# Altium project CommunicationBoard.PrjPcb
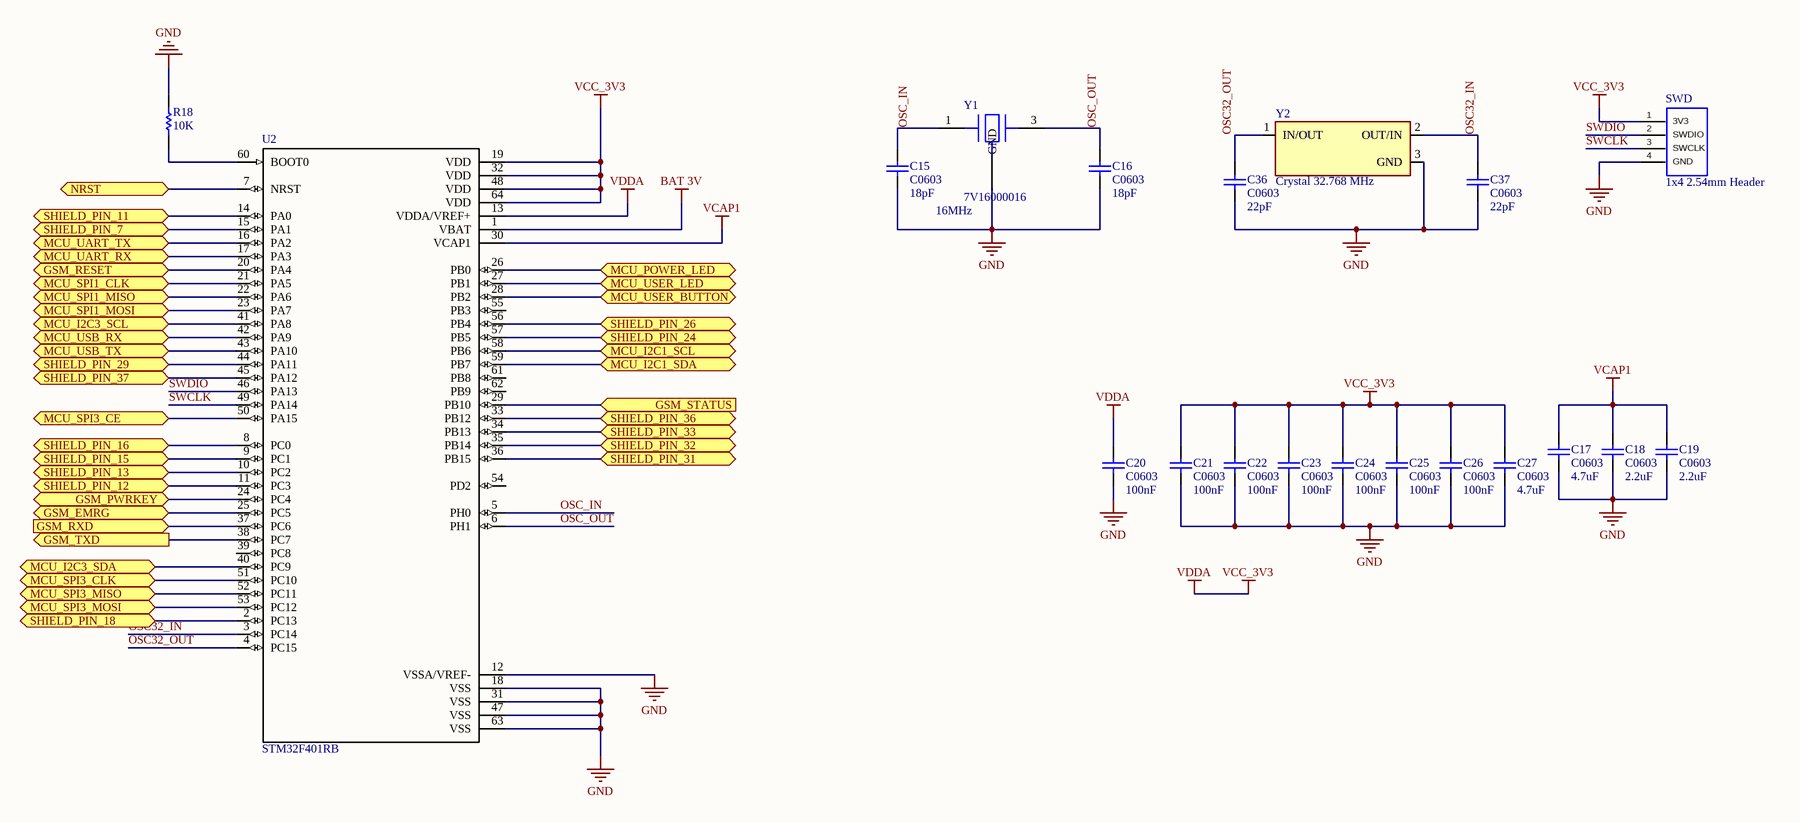
[diagram p0: MCU.SchDoc]
6 sheets, 100 parts. Net scope: flat (ports and power ports of the same name join across sheets).
Board files: CommunicationBoard.PcbDoc, PCB1.PcbDoc
Sheets:
  MCU.SchDoc
  gsm2.SchDoc
  USER_IO.SchDoc
  USB-PC.SchDoc
  POWER.SchDoc
  gsm1.SchDoc

## Sheet MCU.SchDoc
size A3

### Parts
C15  C0603  value 18pF  [C0603]
C16  C0603  value 18pF  [C0603]
C17  C0603  value 4.7uF  [C0603]
C18  C0603  value 2.2uF  [C0603]
C19  C0603  value 2.2uF  [C0603]
C20  C0603  value 100nF  [C0603]
C21  C0603  value 100nF  [C0603]
C22  C0603  value 100nF  [C0603]
C23  C0603  value 100nF  [C0603]
C24  C0603  value 100nF  [C0603]
C25  C0603  value 100nF  [C0603]
C26  C0603  value 100nF  [C0603]
C27  C0603  value 4.7uF  [C0603]
C36  C0603  value 22pF  [C0603]
C37  C0603  value 22pF  [C0603]
R18  value 10K  [CC1608-0603]  (hidden comment: Res0603)
SWD  1x4 2.54mm Header  [1x4 2.54mm Header]
U2  STM32F401RB  [STM32F401RE]
Y1  7V16000016  value 16MHz  [7V16000016]
Y2  Crystal 32.768 MHz  [Crystal 32.768 MHz]

### Ports
GSM_EMRG (bidir), GSM_PWRKEY (bidir), GSM_RESET (bidir), GSM_RXD (in), GSM_STATUS (in), GSM_TXD (out), MCU_I2C1_SCL, MCU_I2C1_SDA, MCU_I2C3_SCL, MCU_I2C3_SDA, MCU_POWER_LED, MCU_SPI1_CLK, MCU_SPI1_MISO, MCU_SPI1_MOSI, MCU_SPI3_CE, MCU_SPI3_CLK, MCU_SPI3_MISO, MCU_SPI3_MOSI, MCU_UART_RX, MCU_UART_TX, MCU_USB_RX, MCU_USB_TX, MCU_USER_BUTTON, MCU_USER_LED, NRST, SHIELD_PIN_7, SHIELD_PIN_11, SHIELD_PIN_12, SHIELD_PIN_13, SHIELD_PIN_15, SHIELD_PIN_16, SHIELD_PIN_18, SHIELD_PIN_24, SHIELD_PIN_26, SHIELD_PIN_29, SHIELD_PIN_31, SHIELD_PIN_32, SHIELD_PIN_33, SHIELD_PIN_36, SHIELD_PIN_37

### Nets
BAT 3V: U2.1(VBAT)
GND: C15.1 C16.1 C17.2 C18.2 C19.2 C20.2 C21.1 C22.1 C23.1 C24.1 C25.1 C26.1 C27.1 C36.2 C37.2 R18.1 SWD.4(GND) U2.12(VSSA/VREF-) U2.18(VSS) U2.31(VSS) U2.47(VSS) U2.63(VSS) Y1.2(GND) Y2.3(GND)
VCAP1: C17.1 C18.1 C19.1 U2.30(VCAP1)
VCC_3V3: C20.1 C21.2 C22.2 C23.2 C24.2 C25.2 C26.2 C27.2 SWD.1(3V3) U2.13(VDDA/VREF+) U2.19(VDD) U2.32(VDD) U2.48(VDD) U2.64(VDD)  [also labelled VDDA]
GSM_EMRG: U2.25(PC5) ; port GSM_EMRG
GSM_PWRKEY: U2.24(PC4) ; port GSM_PWRKEY
GSM_RXD: U2.37(PC6) ; port GSM_RXD
GSM_STATUS: U2.29(PB10) ; port GSM_STATUS
GSM_TXD: U2.38(PC7) ; port GSM_TXD
MCU_POWER_LED: U2.26(PB0) ; port MCU_POWER_LED
MCU_USER_BUTTON: U2.28(PB2) ; port MCU_USER_BUTTON
MCU_USER_LED: U2.27(PB1) ; port MCU_USER_LED
OSC32_IN: C37.1 U2.3(PC14) Y2.2(OUT/IN)
OSC32_OUT: C36.1 U2.4(PC15) Y2.1(IN/OUT)
OSC_IN: C15.2 U2.5(PH0) Y1.1
OSC_OUT: C16.2 U2.6(PH1) Y1.3
~{RESET}: U2.20(PA4) ; port GSM_RESET
SWCLK: SWD.3(SWCLK) U2.49(PA14)
SWDIO: SWD.2(SWDIO) U2.46(PA13)
USB-RXD: U2.42(PA9) ; port MCU_USB_RX
USB-TXD: U2.43(PA10) ; port MCU_USB_TX
NetR18_2: R18.2 U2.60(BOOT0)
NetR27_2: U2.7(NRST) ; port NRST
NetShield_3: U2.59(PB7) ; port MCU_I2C1_SDA
NetShield_5: U2.58(PB6) ; port MCU_I2C1_SCL
NetShield_7: U2.15(PA1) ; port SHIELD_PIN_7
NetShield_8: U2.16(PA2) ; port MCU_UART_TX
NetShield_10: U2.17(PA3) ; port MCU_UART_RX
NetShield_11: U2.14(PA0) ; port SHIELD_PIN_11
NetShield_12: U2.11(PC3) ; port SHIELD_PIN_12
NetShield_13: U2.10(PC2) ; port SHIELD_PIN_13
NetShield_15: U2.9(PC1) ; port SHIELD_PIN_15
NetShield_16: U2.8(PC0) ; port SHIELD_PIN_16
NetShield_18: U2.2(PC13) ; port SHIELD_PIN_18
NetShield_19: U2.53(PC12) ; port MCU_SPI3_MOSI
NetShield_21: U2.52(PC11) ; port MCU_SPI3_MISO
NetShield_22: U2.50(PA15) ; port MCU_SPI3_CE
NetShield_23: U2.51(PC10) ; port MCU_SPI3_CLK
NetShield_24: U2.57(PB5) ; port SHIELD_PIN_24
NetShield_26: U2.56(PB4) ; port SHIELD_PIN_26
NetShield_27: U2.40(PC9) ; port MCU_I2C3_SDA
NetShield_28: U2.41(PA8) ; port MCU_I2C3_SCL
NetShield_29: U2.44(PA11) ; port SHIELD_PIN_29
NetShield_31: U2.36(PB15) ; port SHIELD_PIN_31
NetShield_32: U2.35(PB14) ; port SHIELD_PIN_32
NetShield_33: U2.34(PB13) ; port SHIELD_PIN_33
NetShield_35: U2.22(PA6) ; port MCU_SPI1_MISO
NetShield_36: U2.33(PB12) ; port SHIELD_PIN_36
NetShield_37: U2.45(PA12) ; port SHIELD_PIN_37
NetShield_38: U2.23(PA7) ; port MCU_SPI1_MOSI
NetShield_40: U2.21(PA5) ; port MCU_SPI1_CLK

Not connected (* = marked no-connect by the designer): U2 39(PC8) 54(PD2) 55(PB3) 61(PB8) 62(PB9); Y1 4,1(GND)

### Library data of the parts
C15-C27 C36 C37 = C0603: Ceramic Chip Capacitor - Standard; Note: Footprint corresponds to dimensions for bulk cassette packaging. This case size has tightened tolerances.; Published: 17-Jul-2002; LatestRevisionDate: 19-Mar-2004; LatestRevisionNote: Silkscreen size reduced.; DatasheetDocument: Mar-2001; PackageDocument: Mar-2001; PackageReference: 0603; Publisher: Altium Limited; Code_JEITA: 0603; Code_IPC: 1608 [0603]; ComponentLink1Description: Manufacturer Link; ComponentLink1URL: http://www.kemet.com/; ComponentLink2Description: Datasheet; ComponentLink2URL: http://www.kemet.com/kemet/web/homepage/kechome.nsf/vapubfilesname/F3102TA.pdf/$file/F3102TA.pdf
R18 = Res0603: Resistor; Manufacturer: Generic Components; Class I: Passive; Published: 8-Jun-2000; Revision: July-2002: Re-released for DXP Platform.; Publisher: Altium Limited; Class II: Resistor
U2 = STM32F401RE

## Sheet gsm2.SchDoc
size A4
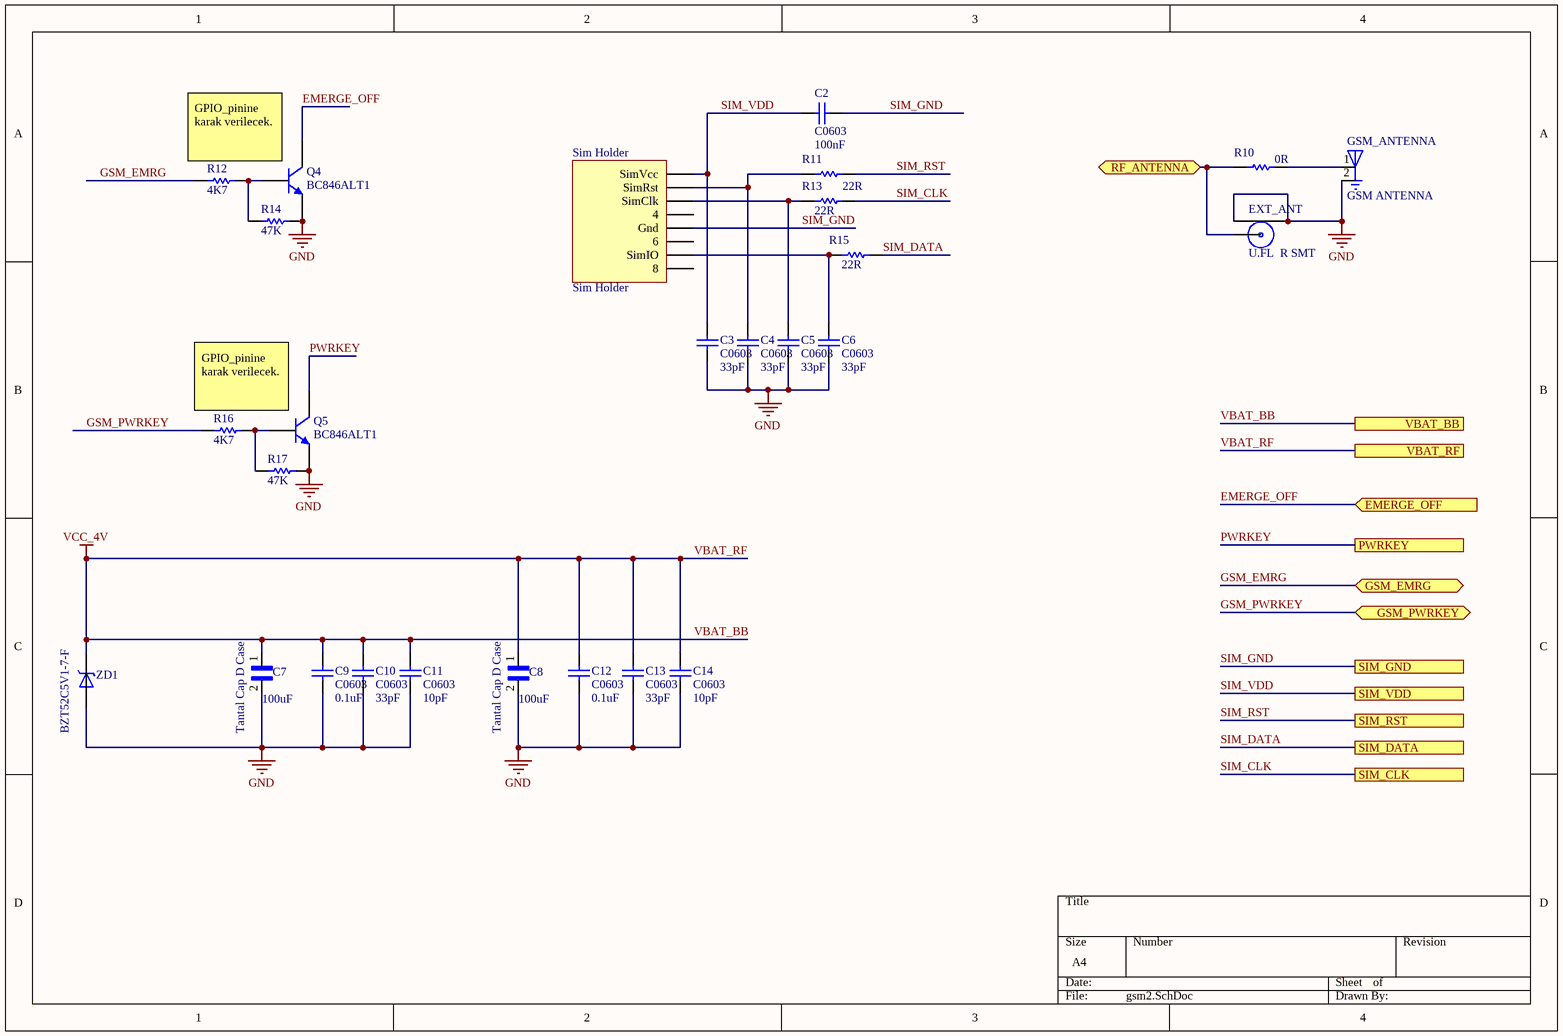
[diagram p1: gsm2.SchDoc]

### Parts
C2  C0603  value 100nF  [C0603]
C3  C0603  value 33pF  [C0603]
C4  C0603  value 33pF  [C0603]
C5  C0603  value 33pF  [C0603]
C6  C0603  value 33pF  [C0603]
C7  Tantal Cap D Case  value 100uF  [Tantal Cap D Case]
C8  Tantal Cap D Case  value 100uF  [Tantal Cap D Case]
C9  C0603  value 0.1uF  [C0603]
C10  C0603  value 33pF  [C0603]
C11  C0603  value 10pF  [C0603]
C12  C0603  value 0.1uF  [C0603]
C13  C0603  value 33pF  [C0603]
C14  C0603  value 10pF  [C0603]
EXT_ANT  U.FL  R SMT  [U.FL  R SMT]
GSM_ANTENNA  GSM ANTENNA  [GSM ANTENNA]
Q4  BC846ALT1  [BC846]
Q5  BC846ALT1  [BC846]
R10  value 0R  [CC1608-0603]  (hidden comment: Res0603)
R11  value 22R  [CC1608-0603]  (hidden comment: Res0603)
R12  value 4K7  [CC1608-0603]  (hidden comment: Res0603)
R13  value 22R  [CC1608-0603]  (hidden comment: Res0603)
R14  value 47K  [CC1608-0603]  (hidden comment: Res0603)
R15  value 22R  [CC1608-0603]  (hidden comment: Res0603)
R16  value 4K7  [CC1608-0603]  (hidden comment: Res0603)
R17  value 47K  [CC1608-0603]  (hidden comment: Res0603)
Sim_Holder  Sim Holder  [SIM HOLDER]
ZD1  BZT52C5V1-7-F  [BZT52C5V1]

### Ports
EMERGE_OFF (in), GSM_EMRG (bidir), GSM_PWRKEY (bidir), PWRKEY, RF_ANTENNA (bidir), SIM_CLK, SIM_DATA, SIM_GND, SIM_RST, SIM_VDD, VBAT_BB, VBAT_RF

### Nets
GND: C3.1 C4.1 C5.1 C6.1 C7.2 C8.2 C9.1 C10.1 C11.1 C12.1 C13.1 C14.1 EXT_ANT.P$2 EXT_ANT.P$3 GSM_ANTENNA.2(GND) Q4.2(E) Q5.2(E) R14.2 R17.2 ZD1.A
VBAT_BB: C7.1 C8.1 C9.2 C10.2 C11.2 C12.2 C13.2 C14.2 ZD1.C ; port VBAT_BB, port VBAT_RF  [also labelled VBAT_RF, VCC_4V]
EMERGE_OFF: Q4.3(C) ; port EMERGE_OFF
GSM_EMRG: R12.1 ; port GSM_EMRG
GSM_PWRKEY: R16.1 ; port GSM_PWRKEY
PWRKEY: Q5.3(C) ; port PWRKEY
RF_ANTENNA: EXT_ANT.P$1 R10.1 ; port RF_ANTENNA
SIM_CLK: R13.2 ; port SIM_CLK
SIM_DATA: R15.2 ; port SIM_DATA
SIM_GND: C2.2 Sim_Holder.5(Gnd) ; port SIM_GND
SIM_RST: R11.2 ; port SIM_RST
SIM_VDD: C2.1 C3.2 Sim_Holder.1(SimVcc) ; port SIM_VDD
NetC4_2: C4.2 R11.1 Sim_Holder.2(SimRst)
NetC5_2: C5.2 R13.1 Sim_Holder.3(SimClk)
NetC6_2: C6.2 R15.1 Sim_Holder.7(SimIO)
NetGSM_ANTENNA_1: GSM_ANTENNA.1(FEEDING) R10.2
NetQ4_1: Q4.1(B) R12.2 R14.1
NetQ5_1: Q5.1(B) R16.2 R17.1

Not connected (* = marked no-connect by the designer): Sim_Holder 4 6 8

### Notes on the sheet
- (near Q4) GPIO_pinine karak verilecek.
- (near Q5) GPIO_pinine karak verilecek.

### Library data of the parts
C2-C6 C9-C14 = C0603: as C15 on sheet MCU; Published: 17-Jul-2002; LatestRevisionDate: 19-Mar-2004; LatestRevisionNote: Silkscreen size reduced.; DatasheetDocument: Mar-2001; PackageDocument: Mar-2001; PackageReference: 0603; Publisher: Altium Limited; Code_JEITA: 0603; Code_IPC: 1608 [0603]; ComponentLink1Description: Manufacturer Link; ComponentLink1URL: http://www.kemet.com/; ComponentLink2Description: Datasheet; ComponentLink2URL: http://www.kemet.com/kemet/web/homepage/kechome.nsf/vapubfilesname/F3102TA.pdf/$file/F3102TA.pdf
Q4 Q5 = BC846ALT1: General Purpose Transistor NPN Silicon; Published: 29-Sep-2000; LatestRevisionDate: 17-Jul-2002; LatestRevisionNote: Re-released for DXP Platform.; DatasheetVersion: 1997; PackageVersion: 1997; PackageReference: 318-08; Publisher: Altium Limited; PackageDescription: SOT-23; 3 Leads; Body 3.0 x 2.6 mm, inc. leads (LxW max); ComponentLink1Description: Manufacturer Link; ComponentLink1URL: http://www.onsemi.com/site/products/landing?taxonomyID=194; ComponentLink2Description: Datasheet; ComponentLink2URL: http://www.onsemi.com/pub/Collateral/BC846ALT1-D.PDF
R10-R17 = Res0603: as R18 on sheet MCU; Published: 8-Jun-2000; Revision: July-2002: Re-released for DXP Platform.; Publisher: Altium Limited; Class II: Resistor

## Sheet USER_IO.SchDoc
size A4
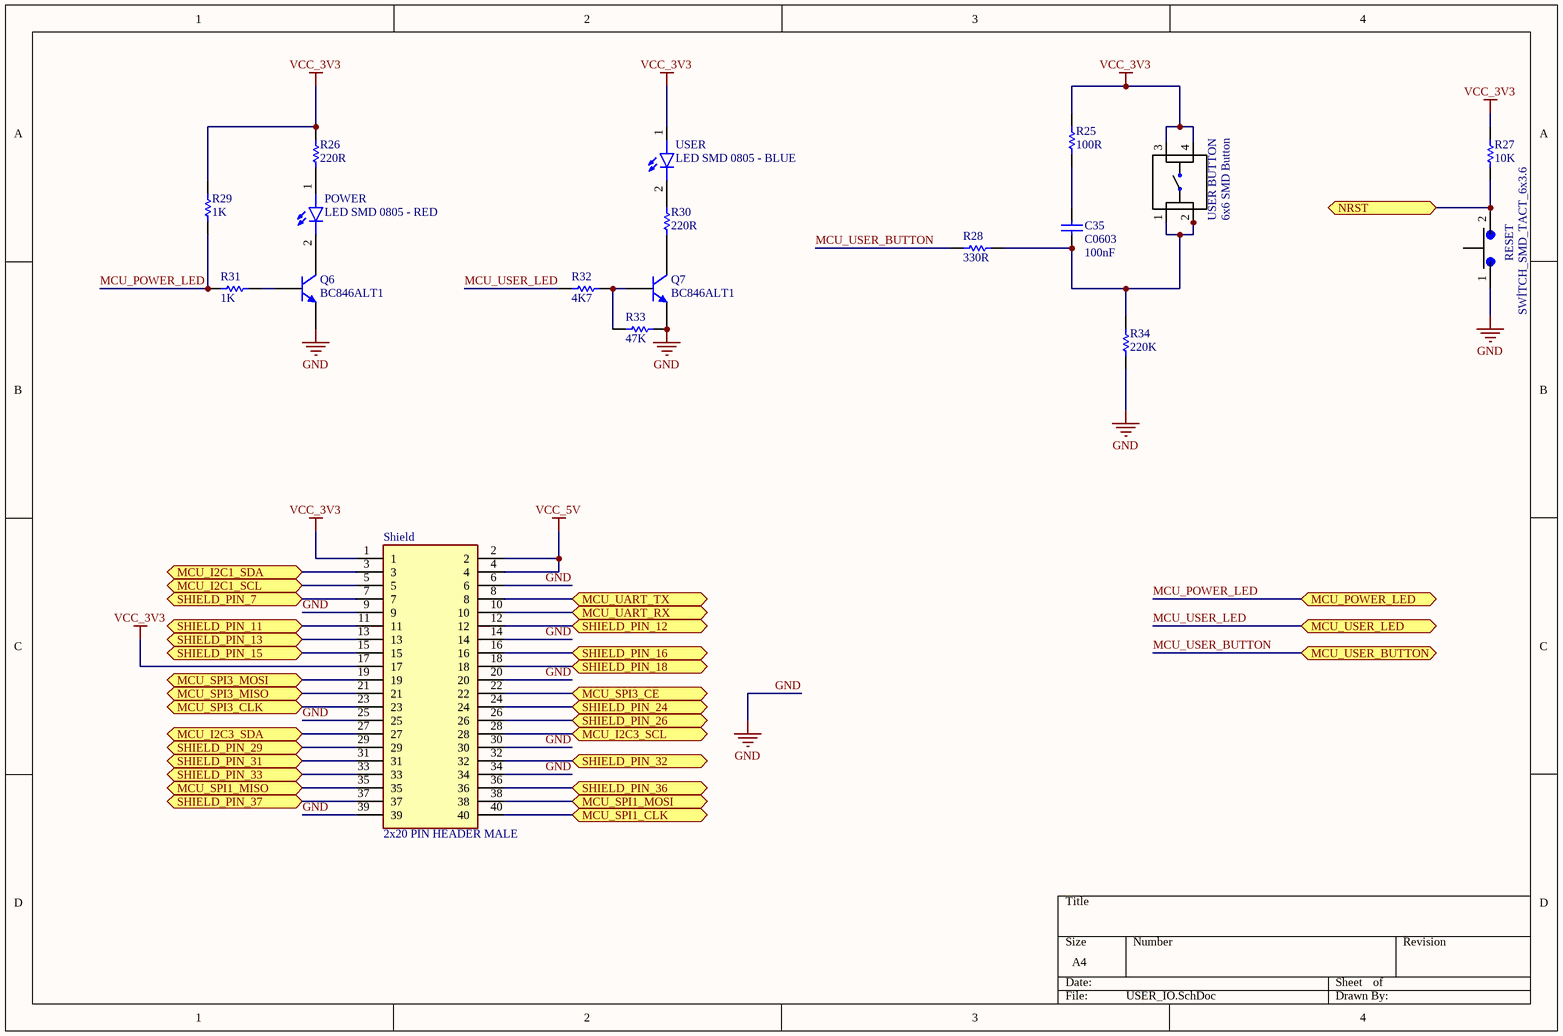
[diagram p2: USER_IO.SchDoc]

### Parts
C35  C0603  value 100nF  [C0603]
POWER  LED SMD 0805 - RED  [LED SMD 0805 - RED]
Q6  BC846ALT1  [BC846]
Q7  BC846ALT1  [BC846]
R25  value 100R  [CC1608-0603]  (hidden comment: Res0603)
R26  value 220R  [CC1608-0603]  (hidden comment: Res0603)
R27  value 10K  [CC1608-0603]  (hidden comment: Res0603)
R28  value 330R  [CC1608-0603]  (hidden comment: Res0603)
R29  value 1K  [CC1608-0603]  (hidden comment: Res0603)
R30  value 220R  [CC1608-0603]  (hidden comment: Res0603)
R31  value 1K  [CC1608-0603]  (hidden comment: Res0603)
R32  value 4K7  [CC1608-0603]  (hidden comment: Res0603)
R33  value 47K  [CC1608-0603]  (hidden comment: Res0603)
R34  value 220K  [CC1608-0603]  (hidden comment: Res0603)
RESET  SWİTCH_SMD_TACT_6x3.6  [SWİTCH_SMD_TACT_6X3.6]
Shield  2x20 PIN HEADER MALE  [2x20 PIN HEADER MALE]
USER  LED SMD 0805 - BLUE  [LED SMD 0805 - BLUE]
USER_BUTTON  6x6 SMD Button  [6x6 Smd Button]

### Ports
MCU_I2C1_SCL, MCU_I2C1_SDA, MCU_I2C3_SCL, MCU_I2C3_SDA, MCU_POWER_LED, MCU_SPI1_CLK, MCU_SPI1_MISO, MCU_SPI1_MOSI, MCU_SPI3_CE, MCU_SPI3_CLK, MCU_SPI3_MISO, MCU_SPI3_MOSI, MCU_UART_RX, MCU_UART_TX, MCU_USER_BUTTON, MCU_USER_LED, NRST, SHIELD_PIN_7, SHIELD_PIN_11, SHIELD_PIN_12, SHIELD_PIN_13, SHIELD_PIN_15, SHIELD_PIN_16, SHIELD_PIN_18, SHIELD_PIN_24, SHIELD_PIN_26, SHIELD_PIN_29, SHIELD_PIN_31, SHIELD_PIN_32, SHIELD_PIN_33, SHIELD_PIN_36, SHIELD_PIN_37

### Nets
GND: Q6.2(E) Q7.2(E) R33.1 R34.1 RESET.1 Shield.6 Shield.9 Shield.14 Shield.20 Shield.25 Shield.30 Shield.34 Shield.39
VCC_3V3: R25.1 R26.2 R27.1 R29.2 Shield.1 Shield.17 USER.1 USER_BUTTON.3 USER_BUTTON.4
VCC_5V: Shield.2 Shield.4
MCU_POWER_LED: R29.1 R31.2 ; port MCU_POWER_LED
MCU_USER_BUTTON: R28.2 ; port MCU_USER_BUTTON
MCU_USER_LED: R32.2 ; port MCU_USER_LED
NetC35_1: C35.1 R28.1 R34.2 USER_BUTTON.1 USER_BUTTON.2
NetC35_2: C35.2 R25.2
NetPOWER_1: POWER.1 R26.1
NetPOWER_2: POWER.2 Q6.3(C)
NetQ6_1: Q6.1(B) R31.1
NetQ7_1: Q7.1(B) R32.1 R33.2
NetQ7_3: Q7.3(C) R30.2
NetR27_2: R27.2 RESET.2 ; port NRST
NetR30_1: R30.1 USER.2
NetShield_3: Shield.3 ; port MCU_I2C1_SDA
NetShield_5: Shield.5 ; port MCU_I2C1_SCL
NetShield_7: Shield.7 ; port SHIELD_PIN_7
NetShield_8: Shield.8 ; port MCU_UART_TX
NetShield_10: Shield.10 ; port MCU_UART_RX
NetShield_11: Shield.11 ; port SHIELD_PIN_11
NetShield_12: Shield.12 ; port SHIELD_PIN_12
NetShield_13: Shield.13 ; port SHIELD_PIN_13
NetShield_15: Shield.15 ; port SHIELD_PIN_15
NetShield_16: Shield.16 ; port SHIELD_PIN_16
NetShield_18: Shield.18 ; port SHIELD_PIN_18
NetShield_19: Shield.19 ; port MCU_SPI3_MOSI
NetShield_21: Shield.21 ; port MCU_SPI3_MISO
NetShield_22: Shield.22 ; port MCU_SPI3_CE
NetShield_23: Shield.23 ; port MCU_SPI3_CLK
NetShield_24: Shield.24 ; port SHIELD_PIN_24
NetShield_26: Shield.26 ; port SHIELD_PIN_26
NetShield_27: Shield.27 ; port MCU_I2C3_SDA
NetShield_28: Shield.28 ; port MCU_I2C3_SCL
NetShield_29: Shield.29 ; port SHIELD_PIN_29
NetShield_31: Shield.31 ; port SHIELD_PIN_31
NetShield_32: Shield.32 ; port SHIELD_PIN_32
NetShield_33: Shield.33 ; port SHIELD_PIN_33
NetShield_35: Shield.35 ; port MCU_SPI1_MISO
NetShield_36: Shield.36 ; port SHIELD_PIN_36
NetShield_37: Shield.37 ; port SHIELD_PIN_37
NetShield_38: Shield.38 ; port MCU_SPI1_MOSI
NetShield_40: Shield.40 ; port MCU_SPI1_CLK

### Library data of the parts
C35 = C0603: as C15 on sheet MCU; Published: 17-Jul-2002; LatestRevisionDate: 19-Mar-2004; LatestRevisionNote: Silkscreen size reduced.; DatasheetDocument: Mar-2001; PackageDocument: Mar-2001; PackageReference: 0603; Publisher: Altium Limited; Code_JEITA: 0603; Code_IPC: 1608 [0603]; ComponentLink1Description: Manufacturer Link; ComponentLink1URL: http://www.kemet.com/; ComponentLink2Description: Datasheet; ComponentLink2URL: http://www.kemet.com/kemet/web/homepage/kechome.nsf/vapubfilesname/F3102TA.pdf/$file/F3102TA.pdf
Q6 Q7 = BC846ALT1: General Purpose Transistor NPN Silicon; Published: 29-Sep-2000; LatestRevisionDate: 17-Jul-2002; LatestRevisionNote: Re-released for DXP Platform.; DatasheetVersion: 1997; PackageVersion: 1997; PackageReference: 318-08; Publisher: Altium Limited; PackageDescription: SOT-23; 3 Leads; Body 3.0 x 2.6 mm, inc. leads (LxW max); ComponentLink1Description: Manufacturer Link; ComponentLink1URL: http://www.onsemi.com/site/products/landing?taxonomyID=194; ComponentLink2Description: Datasheet; ComponentLink2URL: http://www.onsemi.com/pub/Collateral/BC846ALT1-D.PDF
R25-R34 = Res0603: as R18 on sheet MCU; Published: 8-Jun-2000; Revision: July-2002: Re-released for DXP Platform.; Publisher: Altium Limited; Class II: Resistor

## Sheet USB-PC.SchDoc
size A4
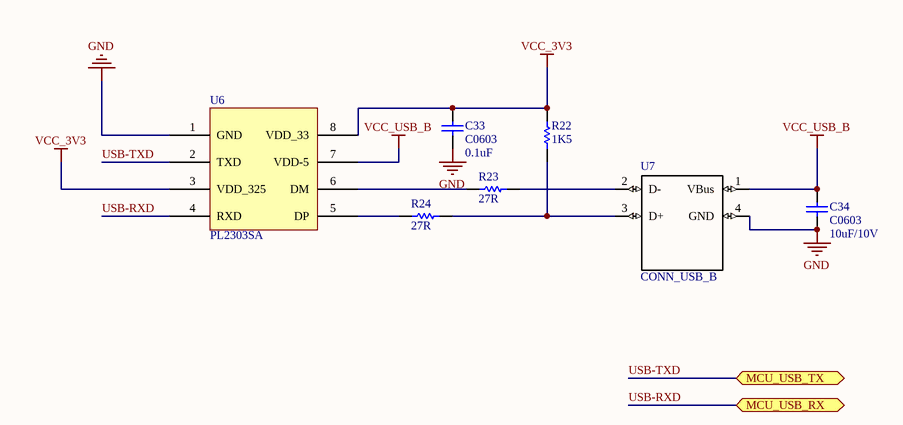
[diagram p3: USB-PC.SchDoc]

### Parts
C33  C0603  value 0.1uF  [C0603]
C34  C0603  value 10uF/10V  [C0603]
R22  value 1K5  [CC1608-0603]  (hidden comment: Res0603)
R23  value 27R  [CC1608-0603]  (hidden comment: Res0603)
R24  value 27R  [CC1608-0603]  (hidden comment: Res0603)
U6  PL2303SA  [PL2302SA]
U7  CONN_USB_B  [CONN_USB_B]

### Ports
MCU_USB_RX, MCU_USB_TX

### Nets
GND: C33.1 C34.1 U6.1(GND) U7.4(GND)
VCC_3V3: C33.2 R22.2 U6.3(VDD_325) U6.8(VDD_33)
VCC_USB_B: C34.2 U6.7(VDD-5) U7.1(VBus)
USB-RXD: U6.4(RXD) ; port MCU_USB_RX
USB-TXD: U6.2(TXD) ; port MCU_USB_TX
NetR22_1: R22.1 R24.1 U7.3(D+)
NetR23_1: R23.1 U7.2(D-)
NetR23_2: R23.2 U6.6(DM)
NetR24_2: R24.2 U6.5(DP)

### Library data of the parts
C33 C34 = C0603: as C15 on sheet MCU; Published: 17-Jul-2002; LatestRevisionDate: 19-Mar-2004; LatestRevisionNote: Silkscreen size reduced.; DatasheetDocument: Mar-2001; PackageDocument: Mar-2001; PackageReference: 0603; Publisher: Altium Limited; Code_JEITA: 0603; Code_IPC: 1608 [0603]; ComponentLink1Description: Manufacturer Link; ComponentLink1URL: http://www.kemet.com/; ComponentLink2Description: Datasheet; ComponentLink2URL: http://www.kemet.com/kemet/web/homepage/kechome.nsf/vapubfilesname/F3102TA.pdf/$file/F3102TA.pdf
R22-R24 = Res0603: as R18 on sheet MCU; Published: 8-Jun-2000; Revision: July-2002: Re-released for DXP Platform.; Publisher: Altium Limited; Class II: Resistor

## Sheet POWER.SchDoc
size A4
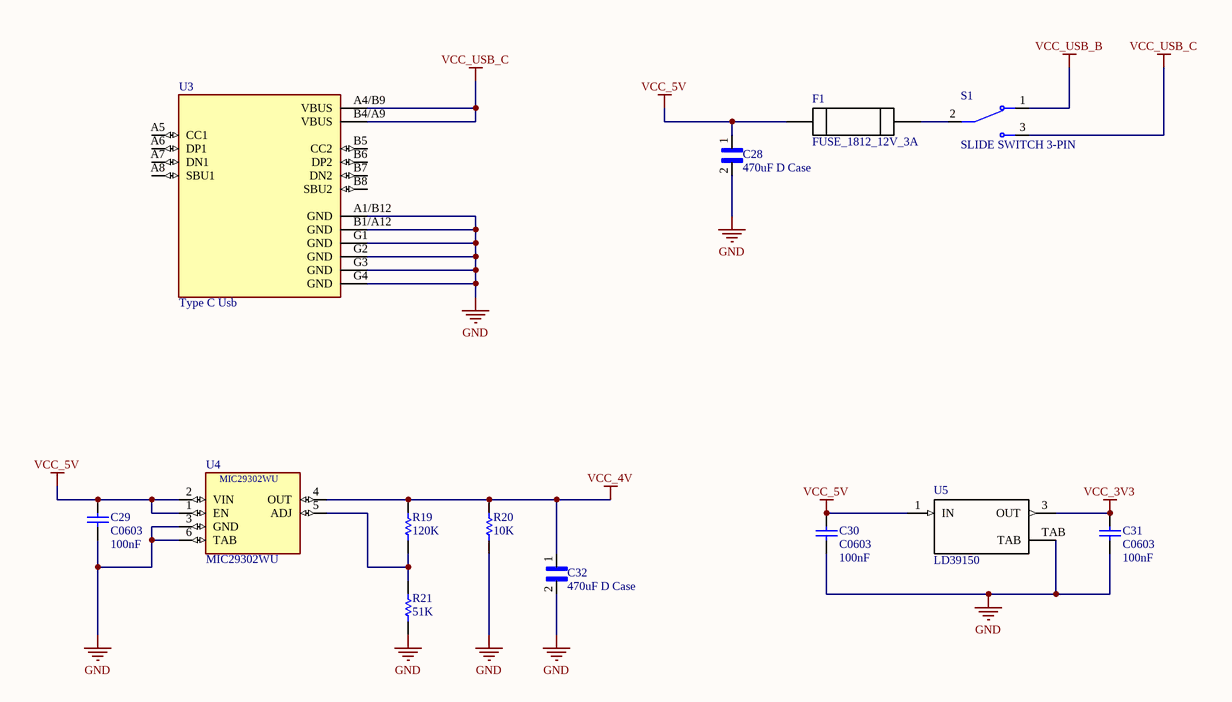
[diagram p4: POWER.SchDoc]

### Parts
C28  470uF D Case  [470uF D Case]
C29  C0603  value 100nF  [C0603]
C30  C0603  value 100nF  [C0603]
C31  C0603  value 100nF  [C0603]
C32  470uF D Case  [470uF D Case]
F1  FUSE_1812_12V_3A  [FUSE_1812_12V_3A]
R19  value 120K  [CC1608-0603]  (hidden comment: Res0603)
R20  value 10K  [CC1608-0603]  (hidden comment: Res0603)
R21  value 51K  [CC1608-0603]  (hidden comment: Res0603)
S1  SLIDE SWITCH 3-PIN  [Slide Switch 3-Pin]
U3  Type C Usb  [Type C Usb]
U4  MIC29302WU  [MIC29302WU]
U5  LD39150  [LD39150DT33-R]

### Nets
GND: C28.2 C29.1 C30.1 C31.1 C32.2 R20.2 R21.2 U3.A1/B12(GND) U3.B1/A12(GND) U3.G1(GND) U3.G2(GND) U3.G3(GND) U3.G4(GND) U4.3(GND) U4.6(TAB) U5.TAB
VCC_3V3: C31.2 U5.3(OUT)
VCC_4V: C32.1 R19.1 R20.1 U4.4(OUT)  [project net VBAT_BB]
VCC_5V: C28.1 C29.2 C30.2 F1.1 U4.1(EN) U4.2(VIN) U5.1(IN)
VCC_USB_B: S1.1
VCC_USB_C: S1.3 U3.A4/B9(VBUS) U3.B4/A9(VBUS)
NetF1_2: F1.2 S1.2
NetR19_2: R19.2 R21.1 U4.5(ADJ)

Not connected (* = marked no-connect by the designer): U3 A5(CC1) A6(DP1) A7(DN1) A8(SBU1) B5(CC2) B6(DP2) B7(DN2) B8(SBU2)

### Library data of the parts
C29-C31 = C0603: as C15 on sheet MCU; Published: 17-Jul-2002; LatestRevisionDate: 19-Mar-2004; LatestRevisionNote: Silkscreen size reduced.; DatasheetDocument: Mar-2001; PackageDocument: Mar-2001; PackageReference: 0603; Publisher: Altium Limited; Code_JEITA: 0603; Code_IPC: 1608 [0603]; ComponentLink1Description: Manufacturer Link; ComponentLink1URL: http://www.kemet.com/; ComponentLink2Description: Datasheet; ComponentLink2URL: http://www.kemet.com/kemet/web/homepage/kechome.nsf/vapubfilesname/F3102TA.pdf/$file/F3102TA.pdf
R19-R21 = Res0603: as R18 on sheet MCU; Published: 8-Jun-2000; Revision: July-2002: Re-released for DXP Platform.; Publisher: Altium Limited; Class II: Resistor

## Sheet gsm1.SchDoc
size A4
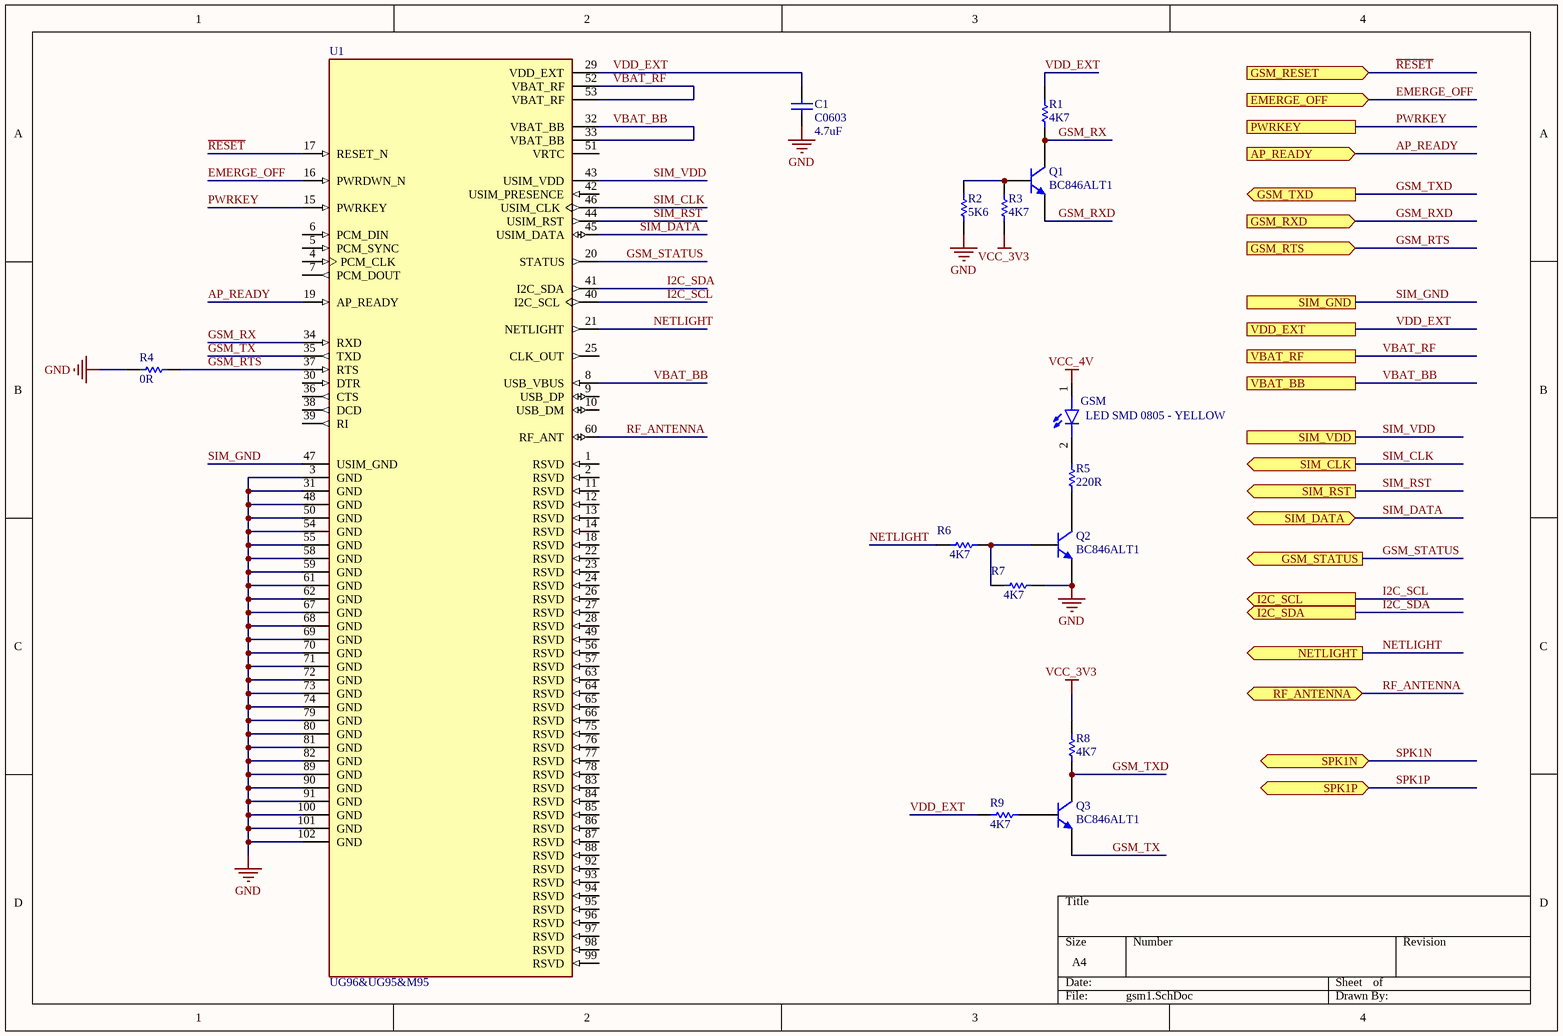
[diagram p5: gsm1.SchDoc]

### Parts
C1  C0603  value 4.7uF  [C0603]
GSM  LED SMD 0805 - YELLOW  [LED SMD 0805 - YELLOW]
Q1  BC846ALT1  [BC846]
Q2  BC846ALT1  [BC846]
Q3  BC846ALT1  [BC846]
R1  value 4K7  [CC1608-0603]  (hidden comment: Res0603)
R2  value 5K6  [CC1608-0603]  (hidden comment: Res0603)
R3  value 4K7  [CC1608-0603]  (hidden comment: Res0603)
R4  value 0R  [CC1608-0603]  (hidden comment: Res0603)
R5  value 220R  [CC1608-0603]  (hidden comment: Res0603)
R6  value 4K7  [CC1608-0603]  (hidden comment: Res0603)
R7  value 4K7  [CC1608-0603]  (hidden comment: Res0603)
R8  value 4K7  [CC1608-0603]  (hidden comment: Res0603)
R9  value 4K7  [CC1608-0603]  (hidden comment: Res0603)
U1  UG96&UG95&M95  [UG96&UG95&M95]

### Ports
AP_READY (in), EMERGE_OFF (in), GSM_RESET (in), GSM_RTS (in), GSM_RXD (in), GSM_STATUS (out), GSM_TXD (out), I2C_SCL (out), I2C_SDA (out), NETLIGHT (out), PWRKEY, RF_ANTENNA (bidir), SIM_CLK (out), SIM_DATA (bidir), SIM_GND, SIM_RST (out), SIM_VDD, SPK1N (bidir), SPK1P (bidir), VBAT_BB, VBAT_RF, VDD_EXT

### Nets
GND: C1.1 Q2.2(E) R2.1 R4.1 R7.2 U1.3(GND) U1.31(GND) U1.48(GND) U1.50(GND) U1.54(GND) U1.55(GND) U1.58(GND) U1.59(GND) U1.61(GND) U1.62(GND) U1.67(GND) U1.68(GND) U1.69(GND) U1.70(GND) U1.71(GND) U1.72(GND) U1.73(GND) U1.74(GND) U1.79(GND) U1.80(GND) U1.81(GND) U1.82(GND) U1.89(GND) U1.90(GND) U1.91(GND) U1.100(GND) U1.101(GND) U1.102(GND)
VBAT_BB: GSM.1 U1.8(USB_VBUS) U1.32(VBAT_BB) U1.33(VBAT_BB) U1.52(VBAT_RF) U1.53(VBAT_RF) ; port VBAT_BB, port VBAT_RF  [also labelled VBAT_RF, VCC_4V]
VCC_3V3: R3.1 R8.2
AP_READY: U1.19(AP_READY) ; port AP_READY
EMERGE_OFF: U1.16(PWRDWN_N) ; port EMERGE_OFF
GSM_RTS: R4.2 U1.37(RTS) ; port GSM_RTS
GSM_RX: Q1.3(C) R1.1 U1.34(RXD)
GSM_RXD: Q1.2(E) ; port GSM_RXD
GSM_STATUS: U1.20(STATUS) ; port GSM_STATUS
GSM_TX: Q3.2(E) U1.35(TXD)
GSM_TXD: Q3.3(C) R8.1 ; port GSM_TXD
I2C_SCL: U1.40(I2C_SCL) ; port I2C_SCL
I2C_SDA: U1.41(I2C_SDA) ; port I2C_SDA
NETLIGHT: R6.1 U1.21(NETLIGHT) ; port NETLIGHT
PWRKEY: U1.15(PWRKEY) ; port PWRKEY
~{RESET}: U1.17(RESET_N) ; port GSM_RESET
RF_ANTENNA: U1.60(RF_ANT) ; port RF_ANTENNA
SIM_CLK: U1.46(USIM_CLK) ; port SIM_CLK
SIM_DATA: U1.45(USIM_DATA) ; port SIM_DATA
SIM_GND: U1.47(USIM_GND) ; port SIM_GND
SIM_RST: U1.44(USIM_RST) ; port SIM_RST
SIM_VDD: U1.43(USIM_VDD) ; port SIM_VDD
SPK1N: port SPK1N
SPK1P: port SPK1P
VDD_EXT: C1.2 R1.2 R9.2 U1.29(VDD_EXT) ; port VDD_EXT
NetGSM_2: GSM.2 R5.2
NetQ1_1: Q1.1(B) R2.2 R3.2
NetQ2_1: Q2.1(B) R6.2 R7.1
NetQ2_3: Q2.3(C) R5.1
NetQ3_1: Q3.1(B) R9.1

Not connected (* = marked no-connect by the designer): U1 1(RSVD) 2(RSVD) 4(PCM_CLK) 5(PCM_SYNC) 6(PCM_DIN) 7(PCM_DOUT) 9(USB_DP) 10(USB_DM) 11(RSVD) 12(RSVD) 13(RSVD) 14(RSVD) 18(RSVD) 22(RSVD) 23(RSVD) 24(RSVD) 25(CLK_OUT) 26(RSVD) 27(RSVD) 28(RSVD) 30(DTR) 36(CTS) 38(DCD) 39(RI) 42(USIM_PRESENCE) 49(RSVD) 51(VRTC) 56(RSVD) 57(RSVD) 63(RSVD) 64(RSVD) 65(RSVD) 66(RSVD) 75(RSVD) 76(RSVD) 77(RSVD) 78(RSVD) 83(RSVD) 84(RSVD) 85(RSVD) 86(RSVD) 87(RSVD) 88(RSVD) 92(RSVD) 93(RSVD) 94(RSVD) 95(RSVD) 96(RSVD) 97(RSVD) 98(RSVD) 99(RSVD)

### Library data of the parts
C1 = C0603: as C15 on sheet MCU; Published: 17-Jul-2002; LatestRevisionDate: 19-Mar-2004; LatestRevisionNote: Silkscreen size reduced.; DatasheetDocument: Mar-2001; PackageDocument: Mar-2001; PackageReference: 0603; Publisher: Altium Limited; Code_JEITA: 0603; Code_IPC: 1608 [0603]; ComponentLink1Description: Manufacturer Link; ComponentLink1URL: http://www.kemet.com/; ComponentLink2Description: Datasheet; ComponentLink2URL: http://www.kemet.com/kemet/web/homepage/kechome.nsf/vapubfilesname/F3102TA.pdf/$file/F3102TA.pdf
Q1-Q3 = BC846ALT1: General Purpose Transistor NPN Silicon; Published: 29-Sep-2000; LatestRevisionDate: 17-Jul-2002; LatestRevisionNote: Re-released for DXP Platform.; DatasheetVersion: 1997; PackageVersion: 1997; PackageReference: 318-08; Publisher: Altium Limited; PackageDescription: SOT-23; 3 Leads; Body 3.0 x 2.6 mm, inc. leads (LxW max); ComponentLink1Description: Manufacturer Link; ComponentLink1URL: http://www.onsemi.com/site/products/landing?taxonomyID=194; ComponentLink2Description: Datasheet; ComponentLink2URL: http://www.onsemi.com/pub/Collateral/BC846ALT1-D.PDF
R1-R9 = Res0603: as R18 on sheet MCU; Published: 8-Jun-2000; Revision: July-2002: Re-released for DXP Platform.; Publisher: Altium Limited; Class II: Resistor

## Nets that join several sheets
GND: MCU (24 pins), gsm2 (20 pins), USER_IO (13 pins), USB-PC (C33.1 C34.1 U6.1 U7.4), POWER (16 pins), gsm1 (33 pins)
VBAT_BB: gsm2 (9 pins), POWER (C32.1 R19.1 R20.1 U4.4), gsm1 (6 pins)
VCC_3V3: MCU (14 pins), USER_IO (9 pins), USB-PC (C33.2 R22.2 U6.3 U6.8), POWER (C31.2 U5.3), gsm1 (R3.1 R8.2)
VCC_5V: USER_IO (Shield.2 Shield.4), POWER (7 pins)
VCC_USB_B: USB-PC (C34.2 U6.7 U7.1), POWER (S1.1)
EMERGE_OFF: gsm2 (Q4.3), gsm1 (U1.16)
GSM_EMRG: MCU (U2.25), gsm2 (R12.1)
GSM_PWRKEY: MCU (U2.24), gsm2 (R16.1)
GSM_RXD: MCU (U2.37), gsm1 (Q1.2)
GSM_STATUS: MCU (U2.29), gsm1 (U1.20)
GSM_TXD: MCU (U2.38), gsm1 (Q3.3 R8.1)
MCU_POWER_LED: MCU (U2.26), USER_IO (R29.1 R31.2)
MCU_USER_BUTTON: MCU (U2.28), USER_IO (R28.2)
MCU_USER_LED: MCU (U2.27), USER_IO (R32.2)
NetR27_2: MCU (U2.7), USER_IO (R27.2 RESET.2)
NetShield_3: MCU (U2.59), USER_IO (Shield.3)
NetShield_5: MCU (U2.58), USER_IO (Shield.5)
NetShield_7: MCU (U2.15), USER_IO (Shield.7)
NetShield_8: MCU (U2.16), USER_IO (Shield.8)
NetShield_10: MCU (U2.17), USER_IO (Shield.10)
NetShield_11: MCU (U2.14), USER_IO (Shield.11)
NetShield_12: MCU (U2.11), USER_IO (Shield.12)
NetShield_13: MCU (U2.10), USER_IO (Shield.13)
NetShield_15: MCU (U2.9), USER_IO (Shield.15)
NetShield_16: MCU (U2.8), USER_IO (Shield.16)
NetShield_18: MCU (U2.2), USER_IO (Shield.18)
NetShield_19: MCU (U2.53), USER_IO (Shield.19)
NetShield_21: MCU (U2.52), USER_IO (Shield.21)
NetShield_22: MCU (U2.50), USER_IO (Shield.22)
NetShield_23: MCU (U2.51), USER_IO (Shield.23)
NetShield_24: MCU (U2.57), USER_IO (Shield.24)
NetShield_26: MCU (U2.56), USER_IO (Shield.26)
NetShield_27: MCU (U2.40), USER_IO (Shield.27)
NetShield_28: MCU (U2.41), USER_IO (Shield.28)
NetShield_29: MCU (U2.44), USER_IO (Shield.29)
NetShield_31: MCU (U2.36), USER_IO (Shield.31)
NetShield_32: MCU (U2.35), USER_IO (Shield.32)
NetShield_33: MCU (U2.34), USER_IO (Shield.33)
NetShield_35: MCU (U2.22), USER_IO (Shield.35)
NetShield_36: MCU (U2.33), USER_IO (Shield.36)
NetShield_37: MCU (U2.45), USER_IO (Shield.37)
NetShield_38: MCU (U2.23), USER_IO (Shield.38)
NetShield_40: MCU (U2.21), USER_IO (Shield.40)
PWRKEY: gsm2 (Q5.3), gsm1 (U1.15)
~{RESET}: MCU (U2.20), gsm1 (U1.17)
RF_ANTENNA: gsm2 (EXT_ANT.P$1 R10.1), gsm1 (U1.60)
SIM_CLK: gsm2 (R13.2), gsm1 (U1.46)
SIM_DATA: gsm2 (R15.2), gsm1 (U1.45)
SIM_GND: gsm2 (C2.2 Sim_Holder.5), gsm1 (U1.47)
SIM_RST: gsm2 (R11.2), gsm1 (U1.44)
SIM_VDD: gsm2 (C2.1 C3.2 Sim_Holder.1), gsm1 (U1.43)
USB-RXD: MCU (U2.42), USB-PC (U6.4)
USB-TXD: MCU (U2.43), USB-PC (U6.2)